# EAGLE design FLC100_shield_v2.1 (EAGLE 6.4)
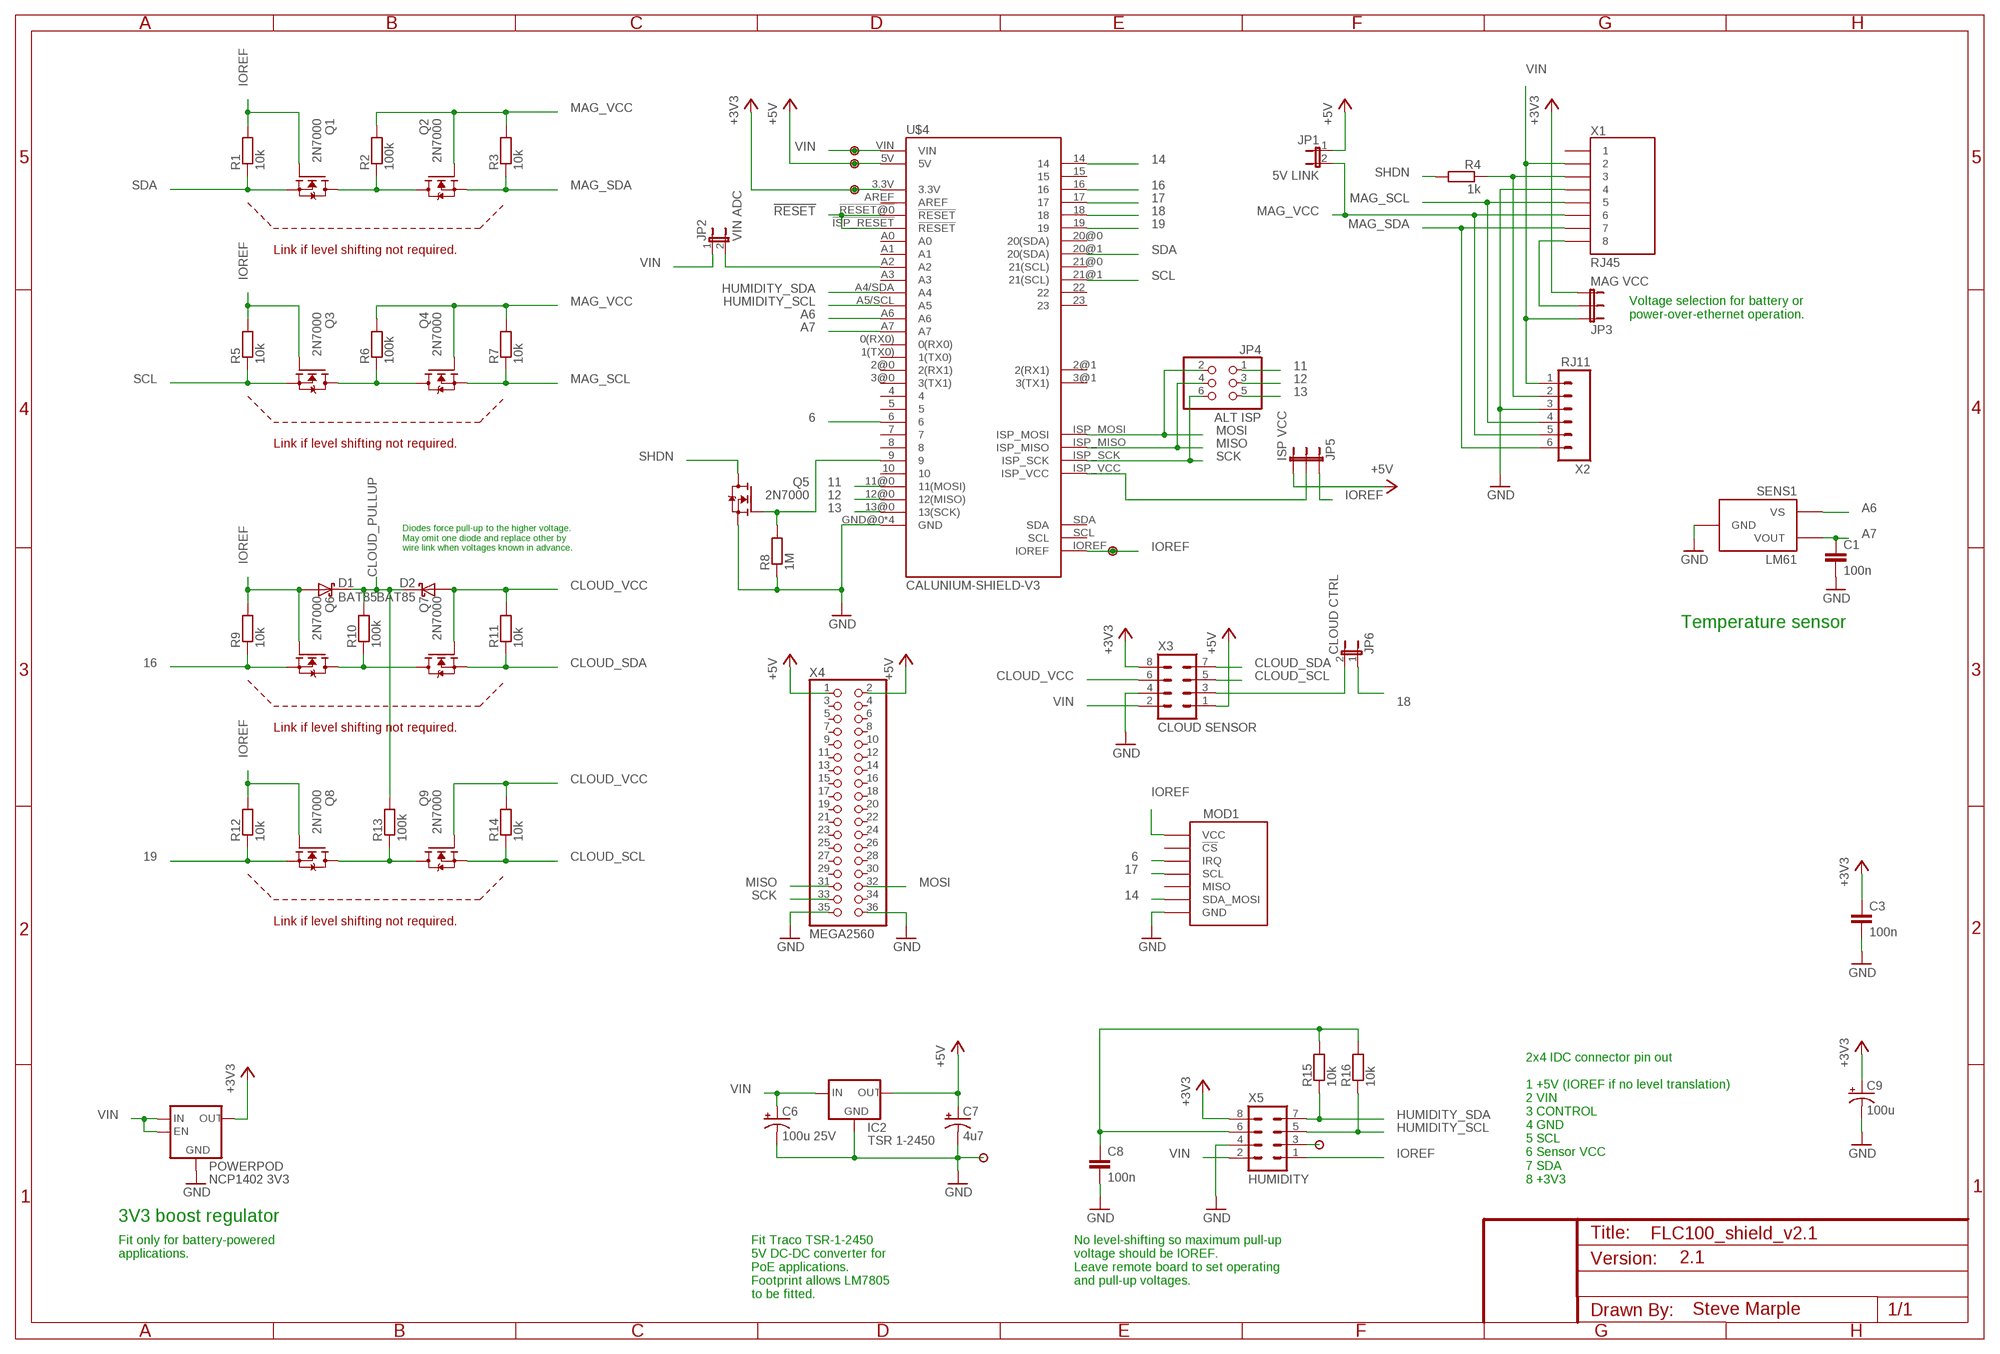
[diagram p0: schematic, sheet 1]

## Parts
C1  100n  CAPPTH  [CAP-PTH-SMALL]
C3  100n  CAPPTH  [CAP-PTH-SMALL]
C6  100u 25V  CAP_POL  [CPOL-RADIAL-100UF-25V-150MIL]
C7  4u7  CAP_POLPTH2  [CPOL-RADIAL-10UF-25V]
C8  100n  CAPPTH  [CAP-PTH-SMALL]
C9  100u  CAP_POLPTH2  [CPOL-RADIAL-10UF-25V]
D1  BAT85  DIODE-SCHOTTKY  [DIODE-TH-0.4]
D2  BAT85  DIODE-SCHOTTKY  [DIODE-TH-0.4]
IC2  TSR 1-2450  V_REG_78XXSIDE  [78XXL]
JP1  5V LINK  JUMPER-2PTH  [1X02]
JP2  VIN ADC  JUMPER-2PTH  [1X02]
JP3  MAG VCC  JUMPER-3PTH  [1X03]
JP4  ALT ISP  PINHD-2X3  [2X03]
JP5  ISP VCC  JUMPER-3PTH  [1X03]
JP6  CLOUD CTRL  JUMPER-2PTH  [1X02]
MOD1  EMBEDDED_ADVENTURES_MOD-1016NO-HOLES  [EMBEDDED_ADVENTURES_MOD-1016-NO-HOLES]
POWERPOD  NCP1402 3V3  CISECO_POWERPOD_NCP1402  [CISECO_POWERPOD_NCP1402]
Q1  2N7000  [TO-92]
Q2  2N7000  [TO-92]
Q3  2N7000  [TO-92]
Q4  2N7000  [TO-92]
Q5  2N7000  [TO-92]
Q6  2N7000  [TO-92]
Q7  2N7000  [TO-92]
Q8  2N7000  [TO-92]
Q9  2N7000  [TO-92]
R1  10k  RESISTOR  [RES-AXIAL-0.4]
R2  100k  RESISTOR  [RES-AXIAL-0.4]
R3  10k  RESISTOR  [RES-AXIAL-0.4]
R4  1k  RESISTOR  [RES-AXIAL-0.4]
R5  10k  RESISTOR  [RES-AXIAL-0.4]
R6  100k  RESISTOR  [RES-AXIAL-0.4]
R7  10k  RESISTOR  [RES-AXIAL-0.4]
R8  1M  RESISTOR  [RES-AXIAL-0.4]
R9  10k  RESISTOR  [RES-AXIAL-0.4]
R10  100k  RESISTOR  [RES-AXIAL-0.4]
R11  10k  RESISTOR  [RES-AXIAL-0.4]
R12  10k  RESISTOR  [RES-AXIAL-0.4]
R13  100k  RESISTOR  [RES-AXIAL-0.4]
R14  10k  RESISTOR  [RES-AXIAL-0.4]
R15  10k  RESISTOR  [RES-AXIAL-0.4]
R16  10k  RESISTOR  [RES-AXIAL-0.4]
SENS1  LM61  [TO-92]
U$1  PAD  [PAD]
U$2  PAD  [PAD]
U$3  PAD  [PAD]
U$4  CALUNIUM-SHIELD-V3  CALUNIUM-SHIELD-V3V3-NO-HOLES-NO-TEXT  [CALUNIUM-SHIELD-NO-OUTLINE-NO-HOLES-NO-TEXT-V3]
U$5  PAD  [PAD]
U$13  PAD  [PAD]
U$14  PAD  [PAD]
X1  RJ45  RJ45-8PTH  [RJ45-8]
X2  RJ11  RJ11-6PTH  [RJ11-6]
X3  CLOUD SENSOR  ML8  [ML8]
X4  MEGA2560  PINHD-2X18  [2X18]
X5  HUMIDITY  ML8  [ML8]

## Nets
6: MOD1.IRQ U$4.6
11: JP4.1 U$4.11@0(11(MOSI))
12: JP4.3 U$4.12@0(12(MISO))
13: JP4.5 U$4.13@0(13(SCK))
14: MOD1.SDA_MOSI U$4.14
16: Q6.1(S) R9.P$1 U$4.16
17: MOD1.SCL U$4.17
18: JP6.1 U$4.18
19: Q8.1(S) R12.P$1 U$4.19
!RESET: U$4.!ISP_RESET(!RESET) U$4.!RESET@0(!RESET)
+3V3 [power]: C3.1 C9.1(+) JP3.3 POWERPOD.VOUT(OUT) U$3.1 U$4.3.3V X3.8 X5.8
+5V [power]: C7.1(+) IC2.OUT JP1.1 JP5.3 U$2.1 U$4.5V X3.1 X4.1 X4.2
A6: SENS1.1(VS) U$4.A6
A7: C1.1 SENS1.2(VOUT) U$4.A7
CLOUD_PULLUP: D1.C D2.C R10.P$2 R13.P$2
CLOUD_SCL: Q9.1(S) R14.P$1 X3.5
CLOUD_SDA: Q7.1(S) R11.P$1 X3.7
CLOUD_VCC: D2.A Q7.2(G) Q9.2(G) R11.P$2 R14.P$2 X3.6
GND [power]: C1.2 C3.2 C6.2(-) C7.2(-) C8.2 C9.2(-) IC2.GND MOD1.GND POWERPOD.GND Q5.1(S) R8.P$1 SENS1.3(GND) U$4.GND@0(GND) U$4.GND@1(GND) U$4.GND@2(GND) U$4.GND@3(GND) U$14.1 X1.4 X2.3 X3.4 X4.35 X4.36 X5.4
HUMIDITY_SCL: R16.P$1 U$4.A5/SCL(A5) X5.5
HUMIDITY_SDA: R15.P$1 U$4.A4/SDA(A4) X5.7
IOREF [power]: D1.A JP5.1 MOD1.VCC Q1.2(G) Q3.2(G) Q6.2(G) Q8.2(G) R1.P$2 R5.P$2 R9.P$2 R12.P$2 U$4.IOREF U$5.1 X5.1
ISP_VCC [power]: JP5.2 U$4.ISP_VCC
MAG_SCL: Q4.1(S) R7.P$1 X1.5 X2.4
MAG_SDA: Q2.1(S) R3.P$1 X1.7 X2.6
MAG_VCC: JP1.2 Q2.2(G) Q4.2(G) R2.P$2 R3.P$2 R6.P$2 R7.P$2 X1.6 X2.5
MISO: JP4.4 U$4.ISP_MISO X4.31
MOSI: JP4.2 U$4.ISP_MOSI X4.32
N$1: Q1.3(D) Q2.3(D) R2.P$1
N$2: Q3.3(D) Q4.3(D) R6.P$1
N$3: JP6.2 X3.3
N$4: Q6.3(D) Q7.3(D) R10.P$1
N$5: Q8.3(D) Q9.3(D) R13.P$1
N$6: R4.P$1 X1.3 X2.2
N$7 [power]: JP3.2 X1.8
N$10 [power]: JP2.2 U$4.A2
N$16: U$13.1 X5.3
N$22: C8.1 R15.P$2 R16.P$2 X5.6
N$26: Q5.2(G) R8.P$2 U$4.9
SCK: JP4.6 U$4.ISP_SCK X4.33
SCL: Q3.1(S) R5.P$1 U$4.21@1(21(SCL))
SDA: Q1.1(S) R1.P$1 U$4.20@1(20(SDA))
SHDN: Q5.3(D) R4.P$2
VIN [power]: C6.1(+) IC2.IN JP2.1 JP3.1 POWERPOD.ENABLE POWERPOD.VIN(IN) U$1.1 U$4.VIN X1.2 X2.1 X3.2 X5.2
Unconnected: MOD1.!CS MOD1.MISO U$4.0(RX0) U$4.1(TX0) U$4.2@0(2(RX1)) U$4.2@1(2(RX1)) U$4.3@0(3(TX1)) U$4.3@1(3(TX1)) U$4.4 U$4.5 U$4.7 U$4.8 U$4.10 U$4.15 U$4.20@0(20(SDA)) U$4.21@0(21(SCL)) U$4.22 U$4.23 U$4.A0 U$4.A1 U$4.A3 U$4.AREF U$4.SCL U$4.SDA X1.1 X4.3 X4.4 X4.5 X4.6 X4.7 X4.8 X4.9 X4.10 X4.11 X4.12 X4.13 X4.14 X4.15 X4.16 X4.17 X4.18 X4.19 X4.20 X4.21 X4.22 X4.23 X4.24 X4.25 X4.26 X4.27 X4.28 X4.29 X4.30 X4.34

## Notes on the sheet
- Link if level shifting not required.
- Voltage selection for battery or
  power-over-ethernet operation.
- Link if level shifting not required.
- Diodes force pull-up to the higher voltage.
  May omit one diode and replace other by
  wire link when voltages known in advance.
- Temperature sensor
- Link if level shifting not required.
- Link if level shifting not required.
- 2x4 IDC connector pin out
  
  1 +5V (IOREF if no level translation)
  2 VIN
  3 CONTROL
  4 GND
  5 SCL
  6 Sensor VCC
  7 SDA
  8 +3V3
- 3V3 boost regulator
- Fit only for battery-powered
  applications.
- Fit Traco TSR-1-2450
  5V DC-DC converter for
  PoE applications.
  Footprint allows LM7805
  to be fitted.
- No level-shifting so maximum pull-up
  voltage should be IOREF.
  Leave remote board to set operating
  and pull-up voltages.
- 2.1
- Steve Marple

## Library data of the parts
C1 C3 C8 = SparkFun:CAP: Capacitor Standard 0603 ceramic capacitor, and 0.1" leaded capacitor.
C6 C7 C9 = SteveMarple:CAP_POL: Capacitor Polarized These are standard SMD and PTH capacitors. Normally 10uF, 47uF, and 100uF in electrolytic and tantalum varieties. Always verify the external diameter of the through hole cap, it varies with capacity, voltage, and manufacturer. The EIA devices should be standard.
D1 D2 = SteveMarple:DIODE-SCHOTTKY
IC2 = SteveMarple:V_REG_78XX: Voltage Regulator Standard 7805 5V regulator. IGO (Input Ground Output). Spark Fun Electronics SKU : COM-00107
JP1 JP2 JP6 = SparkFun:JUMPER-2: Jumper Basic 0.1" spaced jumper. Use with breakaway headers.
JP3 JP5 = SparkFun:JUMPER-3
JP4 = pinhead:PINHD-2X3: PIN HEADER
MOD1 = SteveMarple:EMBEDDED_ADVENTURES_MOD-1016
POWERPOD = SteveMarple:CISECO_POWERPOD_NCP1402
Q1-Q9 = SteveMarple:2N7000: 2N7000 FET
R1-R16 = SteveMarple:RESISTOR: 1/4W PTH resistor
SENS1 = SteveMarple:LM61
U$1-U$3 U$5 U$13 U$14 = SteveMarple:PAD
U$4 = SteveMarple:CALUNIUM-SHIELD-V3
X1 = SteveMarple:RJ45-8: RJ45 Jack Simple RJ45, 8-pin connection - connector for common Cat5, Cat5e, and Cat6 Ethernet cables. Footprint not yet proven in production. Connector sku is PRT-00643; Breakout PCB sku is BOB-00716.
X2 = SteveMarple:RJ11-6: RJ11 Jack Simple 6 pin RJ11 jack. Commonly found on CAT3 devices and Microchip programmers. SKU: PRT-00132
X3 X5 = SteveMarple:ML8
X4 = pinhead:PINHD-2X18: PIN HEADER

## Net classes
1 power: width 0.381 mm
2 antenna: width 0.381 mm

## Board
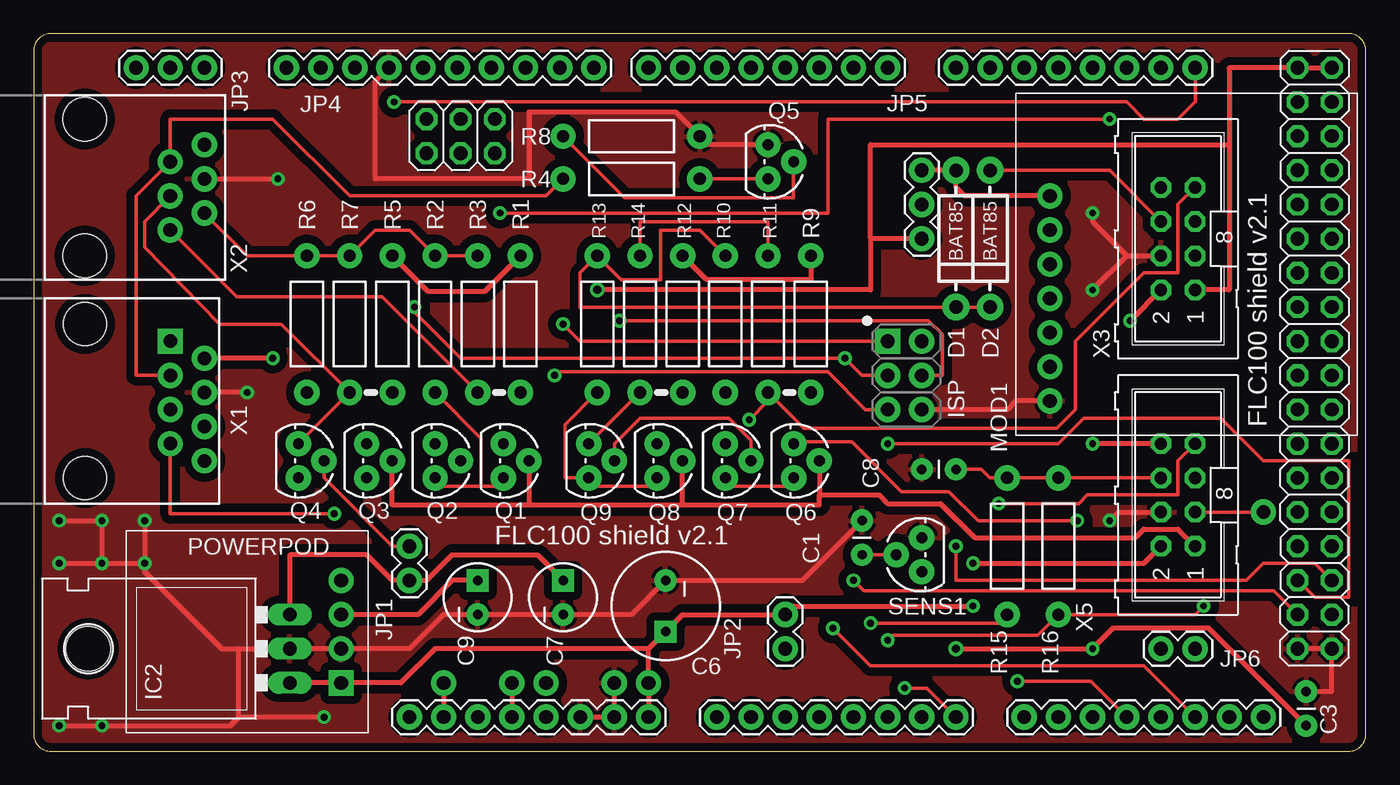
[diagram p1: board, top side]
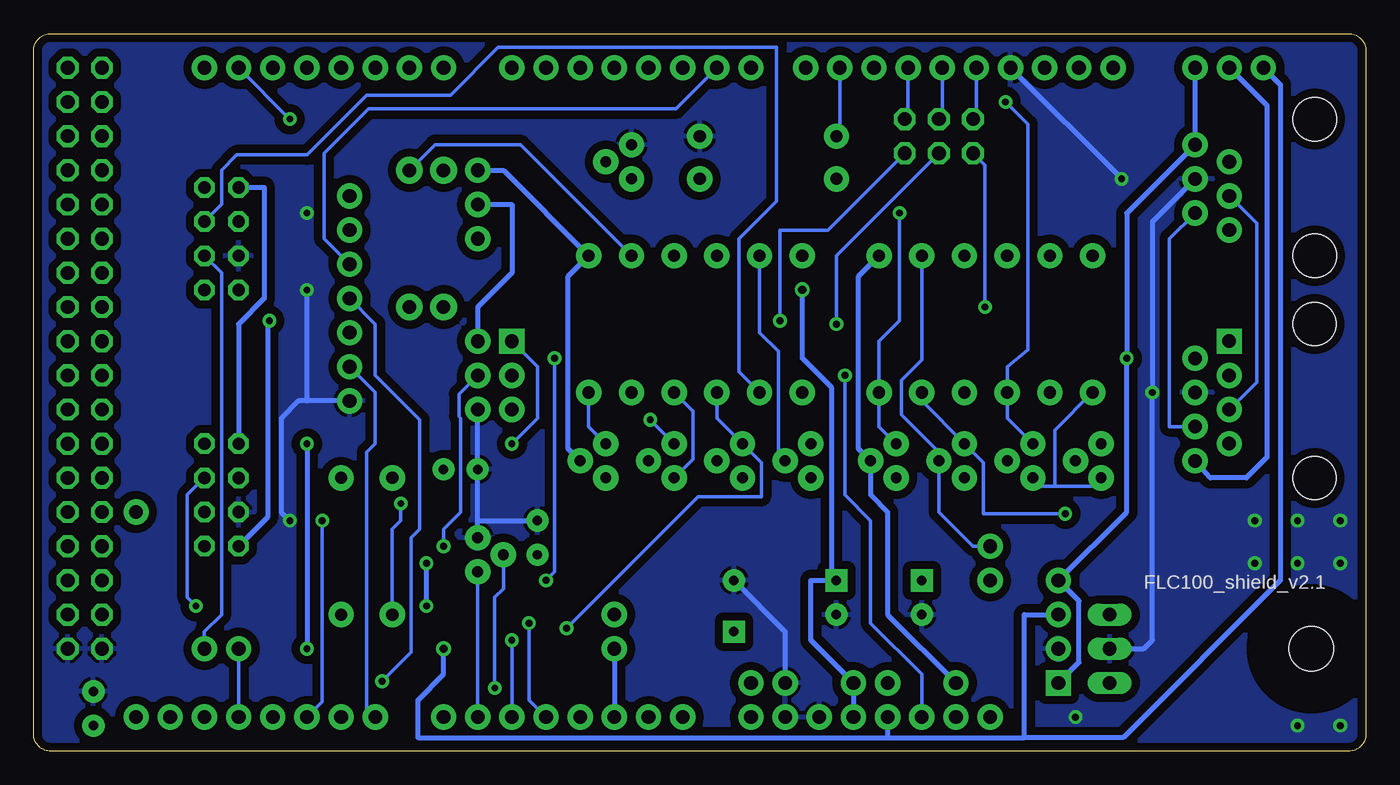
[diagram p2: board, bottom side, seen from below]

Size 99.06 x 53.34 mm. Coordinates in mm from the lower left corner, seen from the top.
Outline: 99.06,1.27 99.06,52.07 arc90 97.79,53.34 1.27,53.34 arc90 0,52.07 0,1.27 arc90 1.27,0 97.79,0 arc90 99.06,1.27
Copper layers (1*16): Top 0.035mm / dielectric 1.5mm / Bottom 0.035mm
Design rules "SparkFun_Iteadstudio_10_12mil": minimum track width 10mil, minimum drill 20mil, track to track 12mil, track to pad 12mil, pad to pad 12mil, via to via 12mil, smd to smd 12mil, copper to edge 0.5mm, drill to drill 8mil, minimum pad ring 12mil, minimum via ring 10mil, stop-mask expansion 4mil, vias tented up to drill 25mil, thermal gap 10mil

### Footprints (pad centres in the part's own frame; a part is rotated, then mirrored left to right if it is on the bottom)
CAP-PTH-SMALL = drill 0.7 pad 1.651: 1 0,0; 2 2.54,0
CPOL-RADIAL-100UF-25V-150MIL = drill 0.7 pad 1.651 square: 1 1.905,0 | drill 0.7 pad 1.651: 2 -1.905,0
CPOL-RADIAL-10UF-25V = drill 0.7 pad 1.651 square: 1 1.27,0 | drill 0.7 pad 1.651: 2 -1.27,0
DIODE-TH-0.4 = drill 1 pad 1.981: A -5.08,0; C 5.08,0
78XXL = drill 1.016 long: GND 0,-3.81; IN -2.54,-3.81; OUT 2.54,-3.81 | hole 3.302: 0,11.176
1X02 = drill 1.016 pad 1.88: 1 0,0; 2 2.54,0
1X03 = drill 1.016 pad 1.88: 1 0,0; 2 2.54,0; 3 5.08,0
2X03 = drill 1.016 octagon: 1 -2.54,-1.27; 2 -2.54,1.27; 3 0,-1.27; 4 0,1.27; 5 2.54,-1.27; 6 2.54,1.27
EMBEDDED_ADVENTURES_MOD-1016-NO-HOLES = drill 1.016 pad 1.88: !CS -2.54,-10.16; GND 10.16,-10.16; IRQ 0,-10.16; MISO 5.08,-10.16; SCL 2.54,-10.16; SDA_MOSI 7.62,-10.16; VCC -5.08,-10.16
CISECO_POWERPOD_NCP1402 = drill 1.016 pad 1.88: ENABLE 3.81,-6.985; GND -1.27,-6.985; VOUT 1.27,-6.985 | drill 1.016 pad 1.88 square: VIN -3.81,-6.985
TO-92 = drill 0.813 pad 1.88: 1 -1.27,0; 2 0,1.905; 3 1.27,0
RES-AXIAL-0.4 = drill 0.9 pad 1.88: P$1 -5.08,0; P$2 5.08,0
PAD = drill 1.016 pad 1.88: 1 0,0
CALUNIUM-SHIELD-NO-OUTLINE-NO-HOLES-NO-TEXT-V3 = drill 1.016 pad 1.88: 0(RX0) 0,21.59; 1(TX0) -2.54,21.59; 2@0 -5.08,21.59; 2@1 17.78,21.59; 3.3V -27.94,-26.67; 3@0 -7.62,21.59; 3@1 15.24,21.59; 4 -10.16,21.59; 5 -12.7,21.59; 5V -25.4,-26.67; 6 -15.24,21.59; 7 -17.78,21.59; 8 -21.844,21.59; 9 -24.384,21.59; 10 -26.924,21.59; 11@0 -29.464,21.59; 12@0 -32.004,21.59; 13@0 -34.544,21.59; 14 10.16,-26.67; 15 12.7,-26.67; 16 15.24,-26.67; 17 17.78,-26.67; 18 20.32,-26.67; 19 22.86,-26.67; 20@0 25.4,-26.67; 20@1 20.32,21.59; 21@0 27.94,-26.67; 21@1 22.86,21.59; 22 5.08,21.59; 23 7.62,21.59; !ISP_RESET 0,-3.81; !RESET@0 -30.48,-26.67; A0 -12.7,-26.67; A1 -10.16,-26.67; A2 -7.62,-26.67; A3 -5.08,-26.67; A4/SDA -2.54,-26.67; A5/SCL 0,-26.67; A6 2.54,-26.67; A7 5.08,-26.67; AREF -39.624,21.59; GND@0 -22.86,-26.67; GND@1 -20.32,-26.67; GND@2 -37.084,21.59; GND@3 2.54,-3.81; IOREF -33.02,-26.67; ISP_MOSI 2.54,-1.27; ISP_SCK 0,-1.27; ISP_VCC 2.54,1.27; NC -35.56,-26.67; NC@0 12.7,21.59; NC@1 10.16,21.59; SCL -44.704,21.59; SDA -42.164,21.59; VIN -17.78,-26.67 | drill 1.016 pad 1.88 square: ISP_MISO 0,1.27
RJ45-8 = drill 1 pad 1.88 square: 1 -4.445,6.35 | drill 1 pad 1.88: 2 -3.175,8.89; 3 -1.905,6.35; 4 -0.635,8.89; 5 0.635,6.35; 6 1.905,8.89; 7 3.175,6.35; 8 4.445,8.89 | hole 3.2: -5.715,0; 5.715,0
RJ11-6 = drill 1.016 pad 1.88: 1 1.905,8.89; 2 3.175,6.35; 3 4.445,8.89; 4 5.715,6.35; 5 6.985,8.89; 6 8.255,6.35 | hole 3.251: 0,0; 10.16,0
ML8 = drill 0.914 octagon: 1 -3.81,-1.27; 2 -3.81,1.27; 3 -1.27,-1.27; 4 -1.27,1.27; 5 1.27,-1.27; 6 1.27,1.27; 7 3.81,-1.27; 8 3.81,1.27
2X18 = drill 1.016 octagon: 1 -21.59,-1.27; 2 -21.59,1.27; 3 -19.05,-1.27; 4 -19.05,1.27; 5 -16.51,-1.27; 6 -16.51,1.27; 7 -13.97,-1.27; 8 -13.97,1.27; 9 -11.43,-1.27; 10 -11.43,1.27; 11 -8.89,-1.27; 12 -8.89,1.27; 13 -6.35,-1.27; 14 -6.35,1.27; 15 -3.81,-1.27; 16 -3.81,1.27; 17 -1.27,-1.27; 18 -1.27,1.27; 19 1.27,-1.27; 20 1.27,1.27; 21 3.81,-1.27; 22 3.81,1.27; 23 6.35,-1.27; 24 6.35,1.27; 25 8.89,-1.27; 26 8.89,1.27; 27 11.43,-1.27; 28 11.43,1.27; 29 13.97,-1.27; 30 13.97,1.27; 31 16.51,-1.27; 32 16.51,1.27; 33 19.05,-1.27; 34 19.05,1.27; 35 21.59,-1.27; 36 21.59,1.27

### Placement (x,y rotation side)
C1  61.59,14.61 90 top
C3  94.61,1.91 90 top
C6  46.99,10.79 270 top
C7  39.37,11.43 90 top
C8  68.58,20.95 180 top
C9  33.02,11.43 90 top
D1  68.58,38.1 270 top
D2  71.12,38.1 270 top
IC2  15.24,7.62 90 top
JP1  27.94,12.7 90 top
JP2  55.88,10.16 270 top
JP3  12.7,50.8 180 top
JP4  31.75,45.72 180 top
JP5  66.04,43.18 270 top
JP6  83.82,7.62 0 top
MOD1  85.72,36.2 270 top
POWERPOD  15.88,8.89 90 top
Q1  34.92,21.59 270 top
Q2  29.84,21.59 270 top
Q3  24.77,21.59 270 top
Q4  19.68,21.59 270 top
Q5  54.61,43.81 270 top
Q6  56.52,21.59 270 top
Q7  51.44,21.59 270 top
Q8  46.35,21.59 270 top
Q9  41.27,21.59 270 top
R1  36.2,31.75 90 top
R2  29.84,31.75 90 top
R3  33.02,31.75 90 top
R4  44.45,42.55 0 top
R5  26.67,31.75 90 top
R6  20.32,31.75 90 top
R7  23.5,31.75 90 top
R8  44.45,45.72 180 top
R9  57.78,31.75 90 top
R10  51.44,31.75 90 top
R11  54.61,31.75 90 top
R12  48.26,31.75 90 top
R13  41.91,31.75 90 top
R14  45.09,31.75 90 top
R15  72.39,15.24 90 top
R16  76.2,15.24 90 top
SENS1  66.04,14.61 90 top
U$1  45.72,5.08 0 top
U$2  38.1,5.08 0 top
U$3  35.56,5.08 0 top
U$4  63.5,29.21 0 top
U$5  30.48,5.08 0 top
U$13  91.44,17.78 0 top
U$14  43.18,5.08 0 top
X1  3.81,26.04 270 top
X2  3.81,46.99 270 top
X3  85.09,38.1 90 top
X4  95.25,29.21 270 top
X5  85.09,19.05 90 top

### Tracks (layer width: path | path; a pad name or v marks a point on that pad's centre or on a via)
6
  Bottom 0.254: U$4.6 51.31,47.75 74.17,47.75 77.47,44.45 77.47,38.1 MOD1.IRQ
11
  Bottom 0.254: JP4.1 34.04,47.24 U$4.11@0
12
  Bottom 0.254: JP4.3 31.5,47.24 U$4.12@0
13
  Bottom 0.254: JP4.5 28.96,47.24 U$4.13@0
14
  Bottom 0.254: U$4.14 74.3,3.17 74.3,22.23 73.66,22.86 73.66,26.67 MOD1.SDA_MOSI
16  (via drill 0.51)
  Top 0.254: v77.6,17.14 70.23,17.14 68.07,19.3 64.52,19.3 60.83,22.99 56.64,22.99 Q6.1
  Bottom 0.254: Q6.1 57.78,24.13 R9.P$1 | U$4.16 77.6,3.68 v77.6,17.14
17  (via drill 0.51)
  Top 0.254: U$4.17 78.61,5.21 v73.15,5.21
  Bottom 0.254: v73.15,5.21 70.99,7.37 70.99,15.88 70.36,16.51 70.36,24.64 73.66,27.94 73.66,31.75 MOD1.SCL
18
  Bottom 0.254: JP6.1 U$4.18
19  (via drill 0.51)
  Top 0.254: U$4.19 82.55,6.35 62.23,6.35 v59.44,9.14
  Bottom 0.254: R12.P$1 48.26,24.77 Q8.1 44.96,21.46 44.96,18.92 49.66,18.92 v59.44,9.14
!RESET  (via drill 0.51)
  Top 0.254: v38.73,27.94 38.99,28.19 59.05,28.19 61.85,25.4 U$4.!ISP_RESET
  Bottom 0.254: U$4.!RESET@0 33.02,5.71 36.83,9.53 36.83,17.14 38.73,19.05 v38.73,27.94
+3V3  (via drill 0.51, 0.6)
  Top 0.381: U$3.1 U$4.3.3V | C3.1 87.38,9.14 80.26,9.14 v78.74,7.62 v68.58,7.62 | C9.1 31.11,12.7 28.57,10.16 POWERPOD.VOUT | X5.8 v78.74,22.86
  Bottom 0.381: POWERPOD.VOUT 25.4,10.16 25.4,1.02 | 35.56,1.02 25.4,1.02 | U$4.3.3V 35.56,1.02 | X5.8 83.82,31.75 81.92,33.66 81.92,41.91 X3.8 | 35.56,1.02 70.48,1.02 70.48,3.81 68.58,5.71 v68.58,7.62 | JP3.3 6.35,49.53 6.35,12.7 18.03,1.02 25.4,1.02 | v78.74,22.86 v78.74,7.62
+5V  (via drill 0.6)
  Top 0.381: IC2.OUT 19.05,14.61 24.77,14.61 26.67,12.7 JP1.1 29.21,12.7 31.11,14.61 37.47,14.61 C7.1 | X3.1 88.9,34.29 88.9,45.09 | 88.9,45.09 62.23,45.09 62.23,38.1 | v41.91,34.29 62.23,34.29 62.23,38.1 | JP5.3 62.23,38.1 | 88.9,45.09 88.9,50.8 X4.1 X4.2
  Bottom 0.381: 39.75,12.7 41.27,12.7 41.27,8.26 U$2.1 U$4.5V | 39.75,12.7 39.75,27.05 41.91,29.21 v41.91,34.29 | 39.75,12.7 C7.1
A6
  Bottom 0.254: SENS1.1 U$4.A6
A7  (via drill 0.51)
  Top 0.254: SENS1.2 C1.1 | U$4.A7 66.42,4.7 v64.77,4.7
  Bottom 0.254: SENS1.2 64.14,12.06 64.77,11.43 v64.77,4.7
CLOUD_PULLUP
  Top 0.254: R10.P$2 49.53,38.73 46.61,38.73 46.61,35.05 43.69,35.05 R13.P$2 40.64,35.56 40.64,33.02 D1.C D2.C
CLOUD_SCL
  Top 0.254: R14.P$1 Q9.1
  Bottom 0.254: X3.5 85.09,40.64 85.09,43.18 83.95,44.32 78.74,44.32 74.3,48.77 68.07,48.77 64.52,52.32 43.81,52.32 43.81,40.89 46.61,38.1 46.61,28.19 R14.P$1
CLOUD_SDA  (via drill 0.51)
  Top 0.254: X3.7 85.09,40.64 85.09,35.56 82.55,35.56 77.47,30.48 77.47,25.4 76.07,24 57.28,24 R11.P$1 54.61,26.04 v53.21,24.64
  Bottom 0.254: v53.21,24.64 Q7.1
CLOUD_VCC
  Top 0.254: Q9.2 43.18,22.86 45.09,24.77 51.69,24.77 53.34,23.11 Q7.2 | X3.6 80.01,43.18 D2.A | R14.P$2 45.09,39.37 54.61,39.37 R11.P$2
  Bottom 0.254: D2.A 69.22,45.09 62.87,45.09 R11.P$2 | Q9.2 43.69,22.1 43.69,29.72 45.09,31.11 R14.P$2
GND  (via drill 0.51)
  Top 0.381: X4.35 X4.36 96.52,4.45 C3.2 | v80.01,17.14 80.64,17.78 X5.4 | 81.28,36.83 X3.4 | v78.74,34.29 81.28,36.83 | U$4.GND@3 72.39,25.4 73.03,26.04 MOD1.GND | Q5.1 50.16,45.09 R8.P$1 47.75,47.5 36.83,47.5 36.83,42.55 25.4,42.55 25.4,49.78 U$4.GND@2 | v15.88,26.67 X1.4 | U$4.GND@0 U$4.GND@1 U$14.1 | X2.3 v18.16,42.55 | C1.2 57.15,12.7 C6.2 44.45,10.16 C7.2 C9.2 30.48,10.16 27.94,7.62 POWERPOD.GND IC2.GND 15.24,7.62 | v1.91,1.91 v5.08,1.91 14.61,1.91 15.24,2.54 | v5.08,13.97 v8.26,13.97 | v8.26,13.97 8.26,13.34 13.97,7.62 15.24,7.62 | v1.91,13.97 v5.08,13.97 | v1.91,17.14 v5.08,17.14 v5.08,13.97 | v8.26,17.14 v8.26,13.97 | v21.59,2.54 15.24,2.54 | 15.24,2.54 15.24,7.62 | v78.74,40.01 78.74,39.37 81.28,36.83
  Bottom 0.381: 66.04,17.14 C1.2 | SENS1.3 66.04,17.14 | 66.04,17.14 C8.2 U$4.GND@3 | v80.01,17.14 80.64,17.78 80.64,24.77 79.38,26.04 78.74,26.04 | MOD1.GND 78.74,26.04 | 78.74,26.04 v78.74,34.29 | X2.3 15.88,39.37 v15.88,26.67 15.88,8.26 16.51,7.62 IC2.GND | U$14.1 43.18,8.89 C6.2 | v18.16,42.55 U$4.GND@2
  pour Bottom (isolate 0.61): 100.33,-1.27 -1.27,-1.27 -1.27,54.61 100.33,54.61
  pour Top (isolate 0.61): 101.6,-2.54 -2.54,-2.54 -2.54,55.88 101.6,55.88
HUMIDITY_SCL  (via drill 0.51)
  Top 0.254: v87,10.79 86.36,10.16 R16.P$1 74.68,8.64 63.88,8.64 v63.5,8.26
  Bottom 0.254: X5.5 87.63,19.05 87.63,11.43 v87,10.79 | v63.5,8.26 U$4.A5/SCL
HUMIDITY_SDA  (via drill 0.51)
  Top 0.254: X5.7 85.09,21.59 85.09,19.05 78.36,19.05 77.72,18.41 v71.75,18.41 | v62.23,9.53 71.75,9.53 R15.P$1
  Bottom 0.254: R15.P$1 72.39,16.51 71.75,17.14 v71.75,18.41 | U$4.A4/SDA 62.23,3.81 v62.23,9.53
IOREF
  Top 0.381: R5.P$2 29.34,34.16 33.53,34.16 R1.P$2 | U$5.1 U$4.IOREF | Q3.2 26.67,18.29 36.83,18.29 | Q1.2 36.83,18.29 | R12.P$2 50.04,35.05 57.78,35.05 R9.P$2 | MOD1.VCC 69.22,41.27 68.58,41.91 D1.A JP5.1 | X5.1 85.09,16.51 82.55,16.51 81.92,15.88 69.98,15.88 67.44,18.41 63.5,18.41 62.87,19.05 58.42,19.05 | Q6.2 58.42,19.05 | 48.26,18.29 Q8.2 | 48.26,18.29 58.42,18.29 58.42,19.05 | 48.26,18.29 36.83,18.29
  Bottom 0.381: U$5.1 35.56,10.16 35.56,17.78 36.83,19.05 Q1.2 37.72,22.48 37.72,35.31 R1.P$2 | JP5.1 64.14,43.18 R9.P$2 59.31,35.31 59.31,22.48 Q6.2
ISP_VCC
  Bottom 0.381: U$4.ISP_VCC 66.04,33.02 63.5,35.56 63.5,40.64 JP5.2
MAG_SCL
  Top 0.254: Q4.1 R7.P$1 18.41,31.75 13.84,31.75 8.26,37.47 8.26,39.37 X2.4
  Bottom 0.254: X1.5 8.13,27.43 8.13,39.24 X2.4
MAG_SDA  (via drill 0.51)
  Top 0.254: X1.7 10.16,17.65 v22.35,17.65 | X2.6 15.11,33.78 25.91,33.78 R3.P$1
  Bottom 0.254: v22.35,17.65 28.45,17.65 28.45,21.46 Q2.1 33.02,26.04 R3.P$1
MAG_VCC
  Top 0.254: Q4.2 21.59,20.32 26.67,15.24 JP1.2 | R3.P$2 R2.P$2 27.94,38.73 25.4,38.73 R7.P$2 R6.P$2 15.88,36.83 X2.5
  Bottom 0.254: JP1.2 29.21,15.24 31.75,17.78 Q2.2 31.75,22.23 34.54,25.02 34.54,27.56 33.02,29.08 R3.P$2 | X1.6 14.61,24.13 14.61,38.1 X2.5
MISO  (via drill 0.51)
  Top 0.254: v39.37,31.75 40.64,30.48 U$4.ISP_MISO | X4.31 95.25,11.43 97.79,11.43 97.79,21.59 91.44,21.59 88.27,24.77 78.11,24.77 76.2,22.86 v63.5,22.86
  Bottom 0.254: v39.37,31.75 39.37,36.83 JP4.4 | v63.5,22.86 61.59,24.77 61.59,28.57 U$4.ISP_MISO
MOSI  (via drill 0.51)
  Top 0.254: v43.56,32 66.55,32 67.56,30.99 67.56,27.94 U$4.ISP_MOSI | X4.32 95.25,13.97 91.44,13.97 90.17,12.7 68.58,12.7 v68.58,15.24
  Bottom 0.254: JP4.2 40.01,38.73 43.56,38.73 v43.56,32 | v68.58,15.24 68.58,16.51 67.31,17.78 67.31,24.77 67.44,24.89 67.44,26.54 U$4.ISP_MOSI
N$1
  Top 0.254: Q2.3 30.48,19.68 33.27,19.68 | 33.27,19.68 34.29,19.68 Q1.3 | R2.P$1 33.27,23.24 33.27,19.68
N$2
  Bottom 0.254: Q4.3 20.32,19.68 23.11,19.68 | 23.11,19.68 24.13,19.68 Q3.3 | R6.P$1 23.11,23.88 23.11,19.68
N$3
  Bottom 0.254: X3.3 85.09,35.56 85.09,10.16 86.36,8.89 JP6.2
N$4
  Top 0.254: Q7.3 52.07,19.68 55.88,19.68 Q6.3
  Bottom 0.254: R10.P$1 50.04,25.27 50.04,21.72 Q7.3
N$5
  Top 0.254: Q8.3 45.72,19.68 41.91,19.68 Q9.3 39.5,20.32 39.5,24.26 R13.P$1
N$6
  Top 0.254: X1.3 7.62,27.94 7.62,41.27 X2.2 10.16,46.99 17.78,46.99 23.5,41.27 38.1,41.27 R4.P$1
N$7
  Bottom 0.381: X1.8 11.56,20.32 8.89,20.32 7.37,21.84 7.37,48.01 JP3.2
N$10
  Bottom 0.381: JP2.2 U$4.A2
N$16
  Top 0.254: U$13.1 X5.3
N$22
  Top 0.254: C8.1 70.48,20.95 71.12,20.32 R15.P$2 R16.P$2 X5.6
N$26
  Top 0.254: Q5.2 56.52,41.15 43.94,41.15 R8.P$2
  Bottom 0.254: R8.P$2 39.12,45.97 U$4.9
SCK  (via drill 0.51)
  Top 0.254: v28.32,33.02 28.32,32.64 31.75,29.21 v60.33,29.21 61.59,27.94 U$4.ISP_SCK | X4.33 92.2,11.94 61.72,11.94 v60.96,12.7
  Bottom 0.254: v28.32,33.02 28.32,43.56 JP4.6 | v60.96,12.7 60.33,13.34 v60.33,29.21
SCL  (via drill 0.51)
  Top 0.254: U$4.21@1 86.36,48.26 85.09,46.99 82.55,46.99 81.28,48.26 v26.8,48.26
  Bottom 0.254: Q3.1 26.67,24.77 R5.P$1 26.67,28.57 25.15,29.84 25.15,46.61 v26.8,48.26
SDA  (via drill 0.51)
  Top 0.254: v80.01,46.99 59.05,46.99 59.05,40.01 v34.67,40.01
  Bottom 0.254: Q1.1 36.2,24.13 R1.P$1 36.2,30.48 34.67,32 v34.67,40.01 | v80.01,46.99 U$4.20@1
SHDN
  Top 0.254: Q5.3 R4.P$2
VIN  (via drill 0.51)
  Top 0.381: v17.78,29.21 X1.2 | X3.2 v81.53,32 | IC2.IN POWERPOD.VIN 27.3,5.08 29.84,7.62 45.72,7.62 | 45.72,7.62 U$1.1 U$4.VIN | 45.72,7.62 C6.1 48.26,10.16 JP2.1 56.52,10.79 v69.85,10.79 | v69.85,13.97 82.55,13.97 X5.2
  Bottom 0.381: JP3.1 X2.1 17.78,40.01 v17.78,29.21 17.78,17.78 POWERPOD.ENABLE 21.34,11.18 21.34,6.6 POWERPOD.VIN | X5.2 81.66,17.4 81.66,31.88 v81.53,32 | v69.85,10.79 v69.85,13.97

### Text on the board
tNames: ISP
tValues: VIN | +3V3 | IOREF | +5V
_tsilk: FLC100 shield v2.1 | FLC100 shield v2.1